# EAGLE schematic BUG0004 (EAGLE 9.2.0)
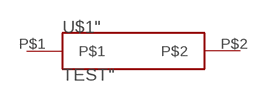
[diagram p0: schematic, sheet 1]

## Parts
U$1"  TEST"  TEST  [TEST]
Unconnected: U$1".P$1 U$1".P$2

## Library data of the parts
U$1" = test_doublequote:TEST